# EasyEDA Pro project ProPrj_WatcheRobot2.0openSource_2026-06-17.epro, board 无线充电底座PCB
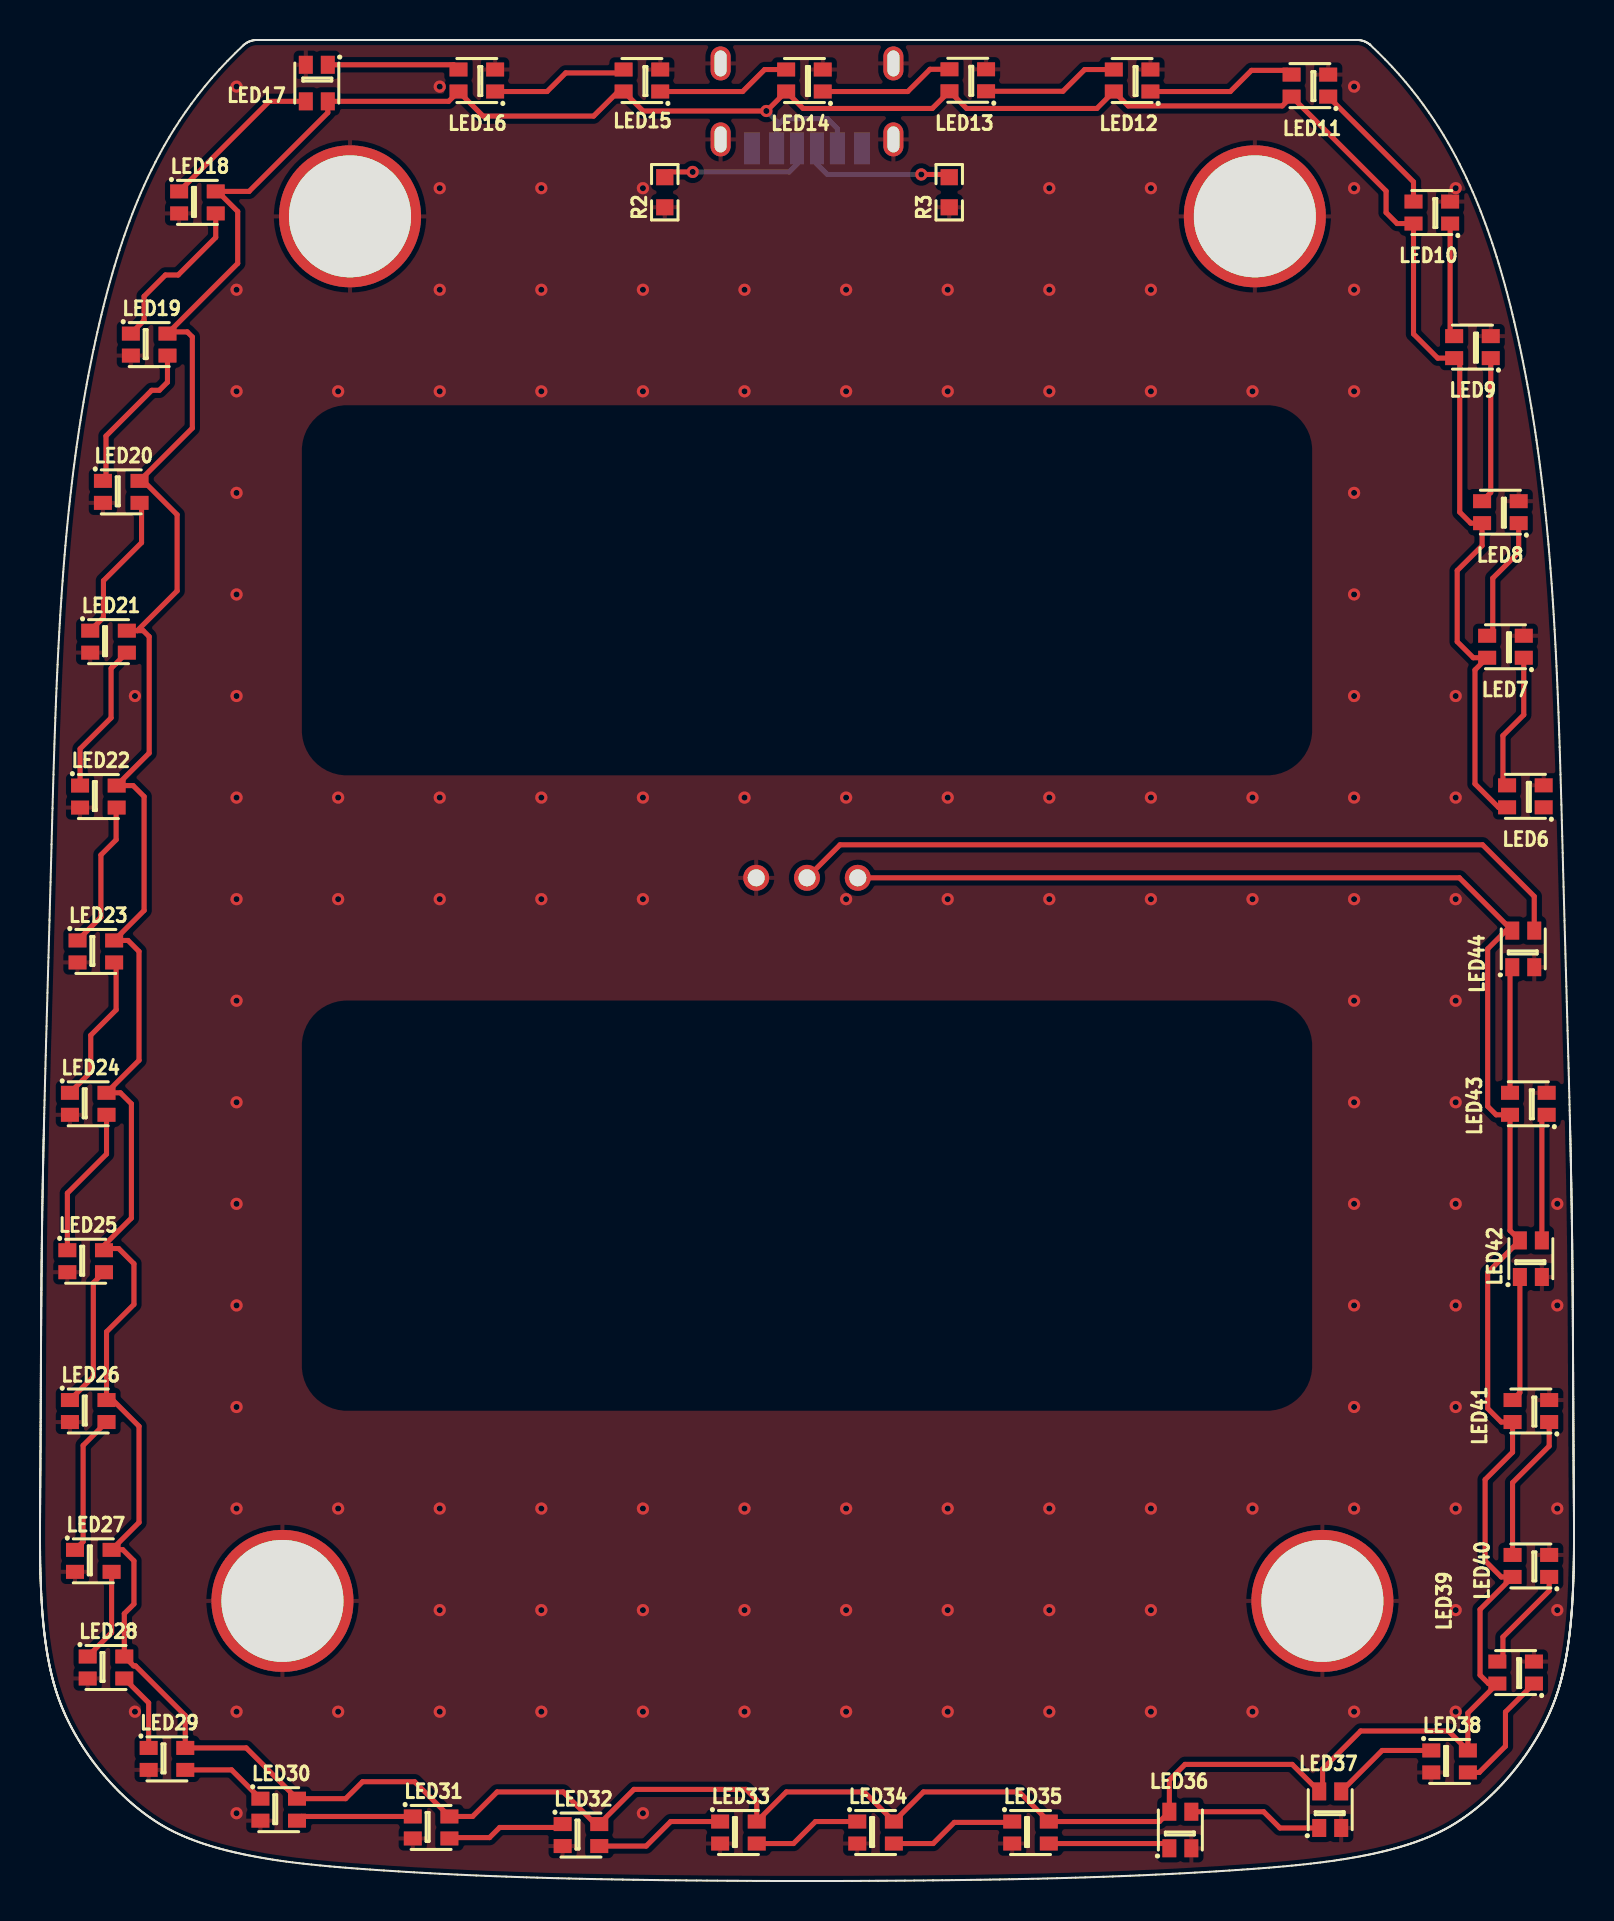
[diagram p4: board, top side]
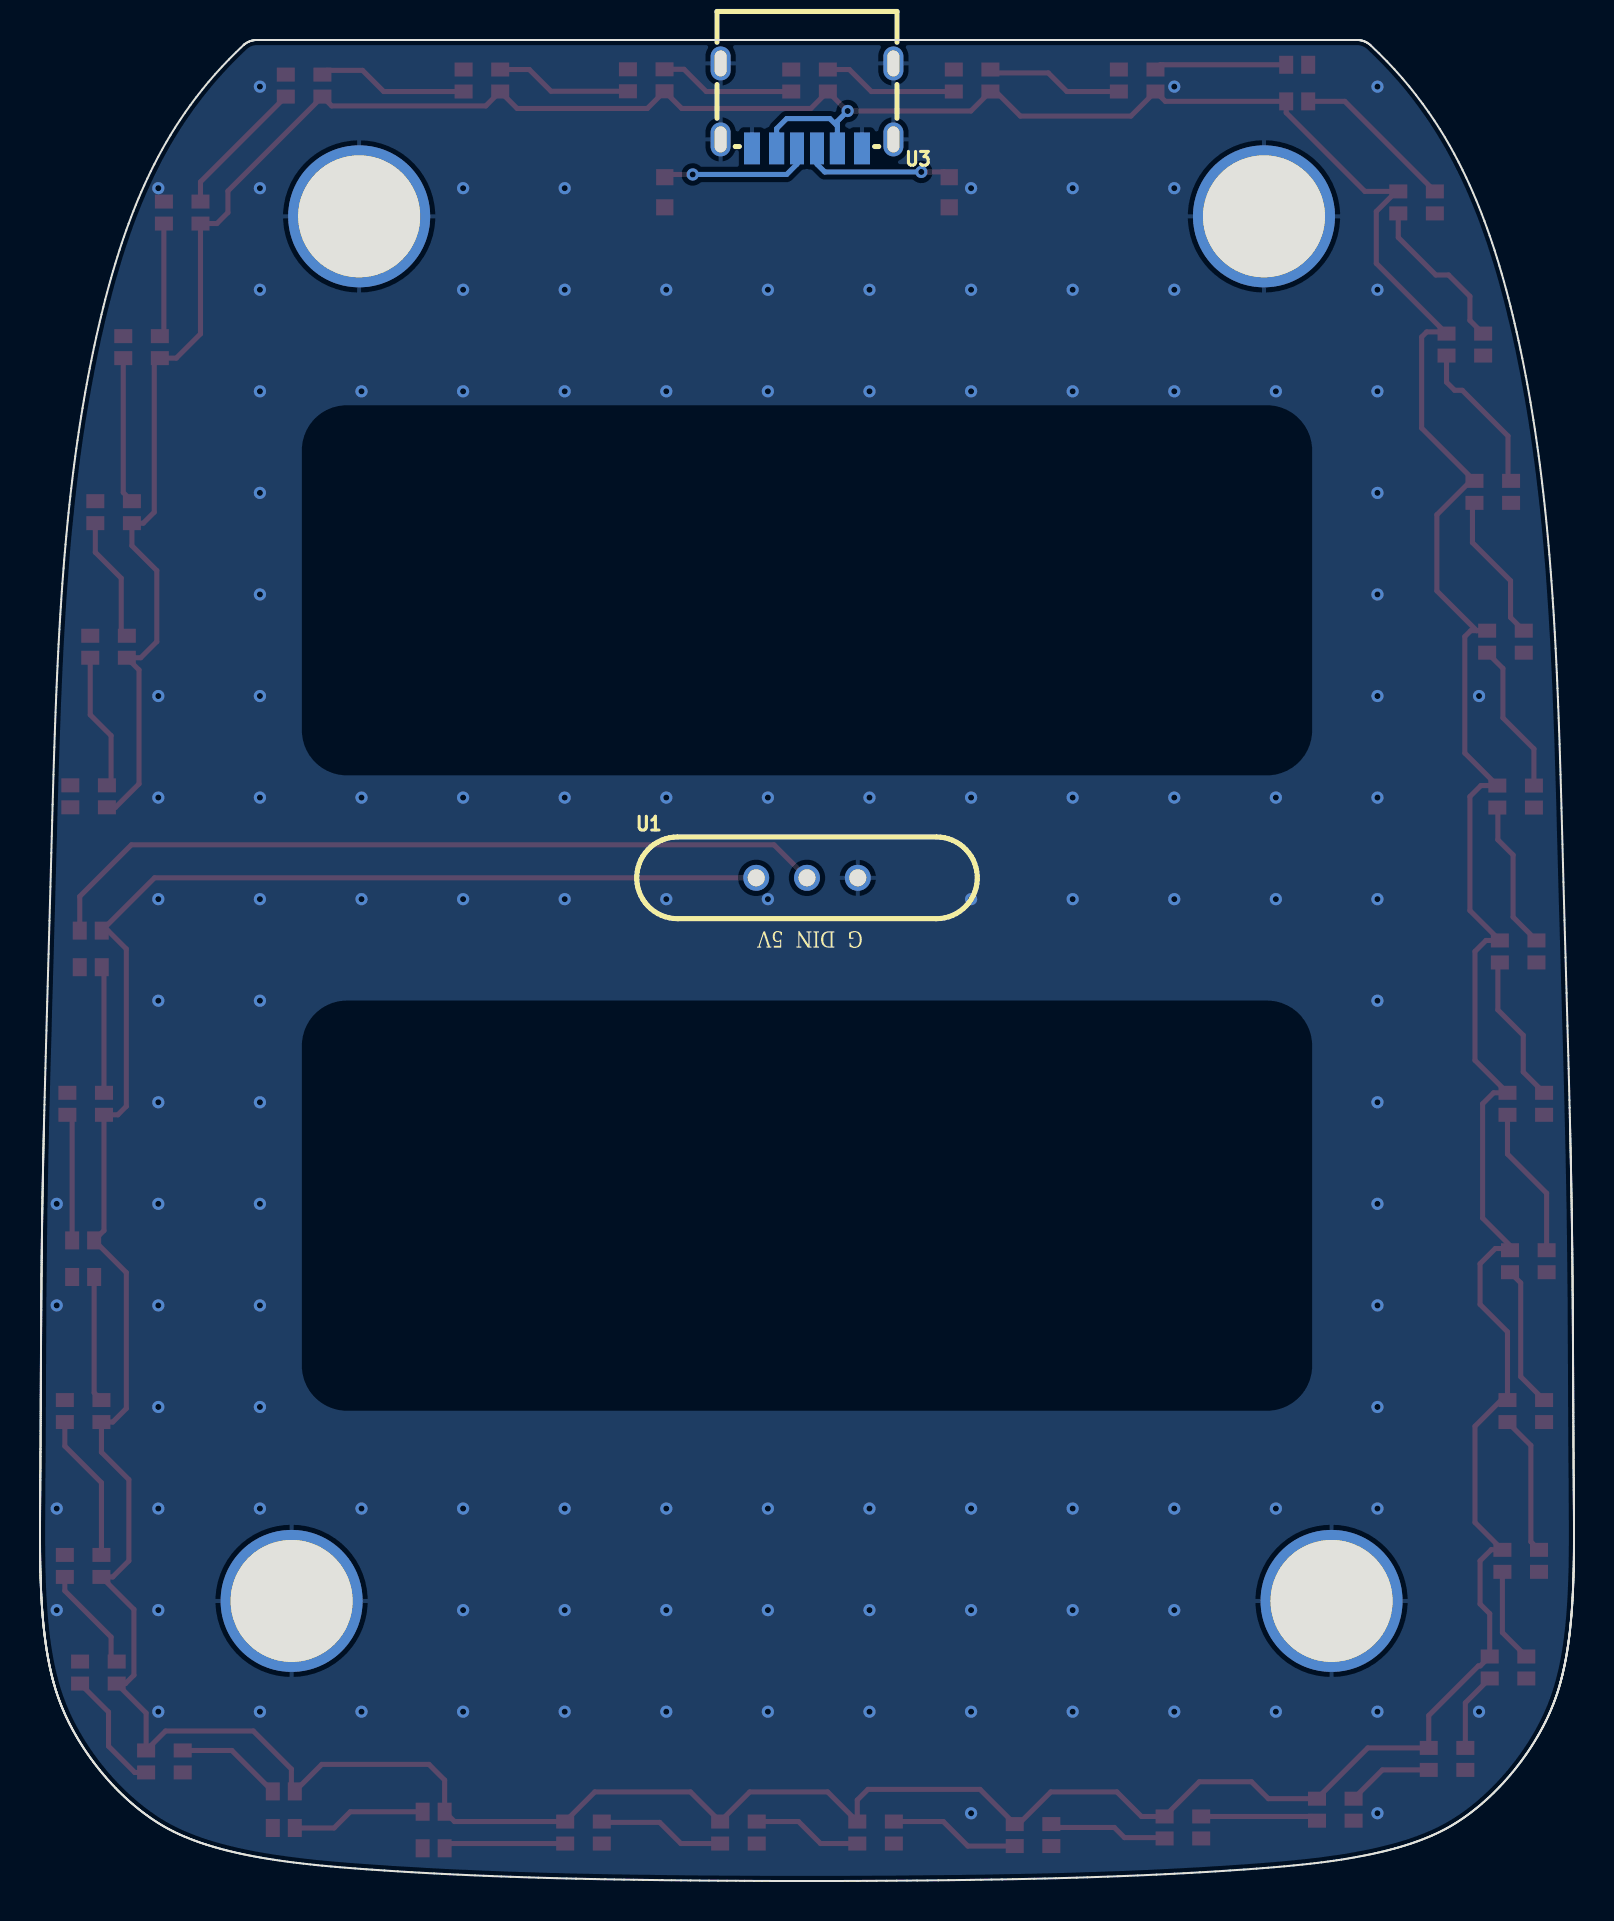
[diagram p5: board, bottom side, seen from below]

Outline 76.7 x 92.08 mm; copper layers: Top Layer, Bottom Layer. Coordinates in mm from the lower left corner of the outline.
Stack: Top Layer 0.035mm / Dielectric1 1.51mm FR4 er 4.5 / Bottom Layer 0.035mm

## Design rules (mm)
spacing copperThickness1oz (default): track to track 0.102, other pairs 0.152 to 0.3
spacing copperThickness2oz: track to track 0.203, other pairs 0.152 to 0.3
track width copperThickness1oz (default): min 0.127, default 0.254, max 2.54
track width copperThickness2oz: min 0.203, default 0.254, max 2.54
differential pair differentialPair (default): width min 0.127, default 0.254, max 2.54; gap min 0.152, default 0.152
net GND uses copperRegion

## Placement (name value [footprint] x y rotation side)
LED6  WS2812B-2020  [LED-SMD_4P-L2.0-W2.0-TL_WS2812B-2020]  74.27 54.25 180 top
LED7  WS2812B-2020  [LED-SMD_4P-L2.0-W2.0-TL_WS2812B-2020]  73.28 61.73 180 top
LED8  WS2812B-2020  [LED-SMD_4P-L2.0-W2.0-TL_WS2812B-2020]  73.02 68.46 180 top
LED9  WS2812B-2020  [LED-SMD_4P-L2.0-W2.0-TL_WS2812B-2020]  71.63 76.72 180 top
LED10  WS2812B-2020  [LED-SMD_4P-L2.0-W2.0-TL_WS2812B-2020]  69.59 83.45 180 top
LED11  WS2812B-2020  [LED-SMD_4P-L2.0-W2.0-TL_WS2812B-2020]  63.5 89.8 180 top
LED12  WS2812B-2020  [LED-SMD_4P-L2.0-W2.0-TL_WS2812B-2020]  54.61 90.05 180 top
LED13  WS2812B-2020  [LED-SMD_4P-L2.0-W2.0-TL_WS2812B-2020]  46.39 90.07 180 top
LED14  WS2812B-2020  [LED-SMD_4P-L2.0-W2.0-TL_WS2812B-2020]  38.22 90.05 180 top
LED15  WS2812B-2020  [LED-SMD_4P-L2.0-W2.0-TL_WS2812B-2020]  30.1 90.05 180 top
LED16  WS2812B-2020  [LED-SMD_4P-L2.0-W2.0-TL_WS2812B-2020]  21.84 90.05 180 top
LED17  WS2812B-2020  [LED-SMD_4P-L2.0-W2.0-TL_WS2812B-2020]  13.84 89.93 270 top
LED18  WS2812B-2020  [LED-SMD_4P-L2.0-W2.0-TL_WS2812B-2020]  7.87 83.96 0 top
LED19  WS2812B-2020  [LED-SMD_4P-L2.0-W2.0-TL_WS2812B-2020]  5.46 76.85 0 top
LED20  WS2812B-2020  [LED-SMD_4P-L2.0-W2.0-TL_WS2812B-2020]  4.06 69.48 0 top
LED21  WS2812B-2020  [LED-SMD_4P-L2.0-W2.0-TL_WS2812B-2020]  3.43 61.99 0 top
LED22  WS2812B-2020  [LED-SMD_4P-L2.0-W2.0-TL_WS2812B-2020]  2.92 54.24 0 top
LED23  WS2812B-2020  [LED-SMD_4P-L2.0-W2.0-TL_WS2812B-2020]  2.79 46.49 0 top
LED24  WS2812B-2020  [LED-SMD_4P-L2.0-W2.0-TL_WS2812B-2020]  2.41 38.87 0 top
LED25  WS2812B-2020  [LED-SMD_4P-L2.0-W2.0-TL_WS2812B-2020]  2.28 31 0 top
LED26  WS2812B-2020  [LED-SMD_4P-L2.0-W2.0-TL_WS2812B-2020]  2.41 23.51 0 top
LED27  WS2812B-2020  [LED-SMD_4P-L2.0-W2.0-TL_WS2812B-2020]  2.67 16.01 0 top
LED28  WS2812B-2020  [LED-SMD_4P-L2.0-W2.0-TL_WS2812B-2020]  3.3 10.68 0 top
LED29  WS2812B-2020  [LED-SMD_4P-L2.0-W2.0-TL_WS2812B-2020]  6.35 6.11 0 top
LED30  WS2812B-2020  [LED-SMD_4P-L2.0-W2.0-TL_WS2812B-2020]  11.94 3.57 0 top
LED31  WS2812B-2020  [LED-SMD_4P-L2.0-W2.0-TL_WS2812B-2020]  19.56 2.68 0 top
LED32  WS2812B-2020  [LED-SMD_4P-L2.0-W2.0-TL_WS2812B-2020]  27.05 2.3 0 top
LED33  WS2812B-2020  [LED-SMD_4P-L2.0-W2.0-TL_WS2812B-2020]  34.92 2.42 0 top
LED34  WS2812B-2020  [LED-SMD_4P-L2.0-W2.0-TL_WS2812B-2020]  41.78 2.42 0 top
LED35  WS2812B-2020  [LED-SMD_4P-L2.0-W2.0-TL_WS2812B-2020]  49.53 2.42 0 top
LED36  WS2812B-2020  [LED-SMD_4P-L2.0-W2.0-TL_WS2812B-2020]  57.02 2.55 90 top
LED37  WS2812B-2020  [LED-SMD_4P-L2.0-W2.0-TL_WS2812B-2020]  64.51 3.57 90 top
LED38  WS2812B-2020  [LED-SMD_4P-L2.0-W2.0-TL_WS2812B-2020]  70.48 5.98 0 top
LED39  WS2812B-2020  [LED-SMD_4P-L2.0-W2.0-TL_WS2812B-2020]  73.78 10.43 180 top
LED40  WS2812B-2020  [LED-SMD_4P-L2.0-W2.0-TL_WS2812B-2020]  74.55 15.76 180 top
LED41  WS2812B-2020  [LED-SMD_4P-L2.0-W2.0-TL_WS2812B-2020]  74.55 23.51 180 top
LED42  WS2812B-2020  [LED-SMD_4P-L2.0-W2.0-TL_WS2812B-2020]  74.55 31.13 90 top
LED43  WS2812B-2020  [LED-SMD_4P-L2.0-W2.0-TL_WS2812B-2020]  74.42 38.87 180 top
LED44  WS2812B-2020  [LED-SMD_4P-L2.0-W2.0-TL_WS2812B-2020]  74.17 46.62 90 top
NOREF  -  [Pad_e24]  60.75 83.26 0 top
NOREF#2  -  [Pad_e26]  64.12 14.01 0 top
NOREF#3  -  [Pad_e25]  15.5 83.26 0 top
NOREF#4  -  [Pad_e27]  12.12 14.01 0 top
R2  5.1kΩ  [R0603_3]  31.24 84.47 90 top
R3  5.1kΩ  [R0603_3]  45.46 84.47 90 top
U1  PR5L5015-3P-C-H  [CONN-TH_PR5L5015-3P-C-H]  38.35 50.18 180 bottom
U3  YTC-TC6-268  [TYPE-C-SMD_YIYUAN_YTC-TC6-268]  38.35 88.78 0 bottom

## Footprints (pads in the part's own frame, mm; a bottom-side part is the same pattern mirrored in y, then rotated)
CONN-TH_PR5L5015-3P-C-H
  round 1.3 hole 0.85: 1(-2.54,0) 2(0,0) 3(2.54,0)
LED-SMD_4P-L2.0-W2.0-TL_WS2812B-2020
  rect 0.9x0.7 smd: 1(-0.915,0.55) 2(-0.915,-0.55) 3(0.915,-0.55) 4(0.915,0.55)
Pad_e24
  round 7.1 hole 6.1: (0,0)
Pad_e25
  round 7.1 hole 6.1: (0,0)
Pad_e26
  round 7.1 hole 6.1: (0,0)
Pad_e27
  round 7.1 hole 6.1: (0,0)
R0603_3
  rect 0.806x0.864 smd: 1(-0.753,0) 2(0.753,0)
TYPE-C-SMD_YIYUAN_YTC-TC6-268
  oval 1x1.7 hole 0.6x1.3: 1(-4.32,1.675) 2(4.32,1.675) 3(4.32,-2.124) 4(-4.32,-2.124)
  rect 0.7x1.6 smd: A5(-0.5,2.124) B5(0.5,2.124)
  rect 0.76x1.6 smd: A9(1.52,2.124) B9(-1.52,2.124)
  rect 0.8x1.6 smd: A12(2.75,2.124) B12(-2.75,2.124)

## Nets
As in the schematic, except:
GND: LED6.2 LED7.2 LED8.2 LED9.2 LED10.2 LED11.2 LED12.2 LED13.2 LED14.2 LED15.2 LED16.2 LED17.2 LED18.2 LED19.2 LED20.2 LED21.2 LED22.2 LED23.2 LED24.2 LED25.2 LED26.2 LED27.2 LED28.2 LED29.2 LED30.2 LED31.2 LED32.2 LED33.2 LED34.2 LED35.2 LED36.2 LED37.2 LED38.2 LED39.2 LED40.2 LED41.2 LED42.2 LED43.2 LED44.2 NOREF. NOREF#2. NOREF#3. NOREF#4. R2.1 R3.1 U1.3 U3.1 U3.2 U3.3 U3.4 U3.A12 U3.B12

Pads without a net: LED6 1

## Via types
v1: diameter 0.61, hole 0.305, Top Layer to Bottom Layer, 125 vias

## Routing (per net, layer and track width the routed paths; a pad name or vN(x,y) marks a point on that pad's centre or on a via; arc(x,y) is an arc through that point)
GND:
  vias: v1(4.75,59.27) v1(4.75,8.47) v1(9.83,89.75) v1(9.83,79.59) v1(9.83,74.51) v1(9.83,69.43) v1(9.83,64.35) v1(9.83,59.27) v1(9.83,54.19) v1(9.83,49.11) v1(9.83,44.03) v1(9.83,38.95) v1(9.83,33.87) v1(9.83,28.79) v1(9.83,23.71) v1(9.83,18.63) v1(9.83,8.47) v1(9.83,3.39) v1(14.91,74.51) v1(14.91,54.19) v1(14.91,49.11) v1(14.91,18.63) v1(14.91,8.47) v1(19.99,89.75) v1(19.99,84.67) v1(19.99,79.59) v1(19.99,74.51) v1(19.99,54.19) v1(19.99,49.11) v1(19.99,18.63) v1(19.99,13.55) v1(19.99,8.47) v1(25.07,84.67) v1(25.07,79.59) v1(25.07,74.51) v1(25.07,54.19) v1(25.07,49.11) v1(25.07,18.63) v1(25.07,13.55) v1(25.07,8.47) v1(30.15,84.67) v1(30.15,79.59) v1(30.15,74.51) v1(30.15,54.19) v1(30.15,49.11) v1(30.15,18.63) v1(30.15,13.55) v1(30.15,8.47) v1(30.15,3.39) v1(35.23,79.59) v1(35.23,74.51) v1(35.23,54.19) v1(35.23,18.63) v1(35.23,13.55) v1(35.23,8.47) v1(40.31,79.59) v1(40.31,74.51) v1(40.31,54.19) v1(40.31,49.11) v1(40.31,18.63) v1(40.31,13.55) v1(40.31,8.47) v1(45.39,79.59) v1(45.39,74.51) v1(45.39,54.19) v1(45.39,49.11) v1(45.39,18.63) v1(45.39,13.55) v1(45.39,8.47) v1(50.47,84.67) v1(50.47,79.59) v1(50.47,74.51) v1(50.47,54.19) v1(50.47,49.11) v1(50.47,18.63) v1(50.47,13.55) v1(50.47,8.47) v1(55.55,84.67) v1(55.55,79.59) v1(55.55,74.51) v1(55.55,54.19) v1(55.55,49.11) v1(55.55,18.63) v1(55.55,13.55) v1(55.55,8.47) v1(60.63,74.51) v1(60.63,54.19) v1(60.63,49.11) v1(60.63,18.63) v1(60.63,8.47) v1(65.71,89.75) v1(65.71,84.67) v1(65.71,79.59) v1(65.71,74.51) v1(65.71,69.43) v1(65.71,64.35) v1(65.71,59.27) v1(65.71,54.19) v1(65.71,49.11) v1(65.71,44.03) v1(65.71,38.95) v1(65.71,33.87) v1(65.71,28.79) v1(65.71,23.71) v1(65.71,18.63) v1(65.71,8.47) v1(70.79,84.67) v1(70.79,59.27) v1(70.79,54.19) v1(70.79,49.11) v1(70.79,44.03) v1(70.79,38.95) v1(70.79,33.87) v1(70.79,28.79) v1(70.79,23.71) v1(70.79,18.63) v1(70.79,13.55) v1(70.79,8.47) v1(75.87,33.87) v1(75.87,28.79) v1(75.87,18.63) v1(75.87,13.55)
VCC_5V: length 363.6
  Top Layer w0.254: LED18.4 8.88,84.51 ; 8.88,84.51 9.89,83.5 9.89,80.91 6.46,77.48 ; 8.88,84.51 10.45,84.51 14.39,88.45 14.39,89.01 20.44,89.01 LED16.4 22.16,88.28 27.68,88.28 28.91,89.5 LED15.4 30.16,88.53 36.34,88.53 LED14.4 38.16,88.66 44.62,88.66 LED13.4 46.33,88.66 52.85,88.66 LED12.4 54.41,88.78 62.12,88.78 LED11.4 67.31,84.53 67.31,83.45 67.86,82.9 68.68,82.9 68.68,77.38 69.89,76.17 LED9.4 70.99,75.89 70.99,68.46 71.54,67.91 LED8.4 72.11,66.79 70.86,65.54 70.86,61.99 71.67,61.18 LED7.4 71.75,60.57 71.75,54.88 72.93,53.7 LED6.4 ; 3.59,16.57 4.14,16.57 4.7,16.01 4.7,13.85 4.22,13.37 LED28.4 4.69,10.76 4.78,10.76 7.26,8.28 LED29.4 10.31,6.66 LED30.4 15.28,4.12 16.13,4.96 18.74,4.96 LED31.4 21.63,3.23 22.86,4.46 26.16,4.46 27.77,2.85 LED32.4 29.7,4.58 35.3,4.58 35.84,4.05 LED33.4 37.32,4.46 41.21,4.46 LED34.4 44.18,4.46 48.96,4.46 50.44,2.97 55.98,2.97 56.47,3.47 56.47,5.05 57.25,5.83 62.61,5.83 LED37.4 64.13,4.65 64.13,5.6 66.04,7.5 70.42,7.5 LED38.4 71.4,8.4 LED39.4 72.43,9.88 72.01,10.3 72.01,13.58 LED40.4 73.06,15.21 72.26,16.01 72.26,20.08 73.63,21.45 LED41.4 73.06,22.96 72.39,23.63 72.39,30.43 LED42.4 73.5,32.53 73.5,38.32 72.81,38.32 72.39,38.75 72.39,46.62 73.3,47.54 LED44.4 70.97,50.18 U1.1 ; 3.59,16.57 4.95,17.93 4.95,22.74 3.64,24.06 LED26.4 3.33,27.47 4.7,28.84 4.7,30.87 3.94,31.63 3.28,31.63 LED25.4 3.2,31.79 4.57,33.16 4.57,38.87 4.02,39.42 LED24.4 4.95,41.05 4.95,46.49 4.4,47.04 LED23.4 5.2,48.54 5.2,54.24 4.66,54.79 LED22.4 5.46,56.42 5.46,62.24 5.16,62.54 4.87,62.54 ; 3.59,16.57 LED27.4 ; 4.87,62.54 6.86,64.53 6.86,68.34 5.16,70.03 4.98,70.03 7.62,72.67 7.62,77.23 7.36,77.48 6.46,77.48 ; 4.87,62.54 LED21.4 ; 6.46,77.48 LED19.4
  Bottom Layer w0.254: U3.B9 36.83,87.77 ; 36.83,87.77 36.83,88.02 v1(36.32,88.53) ; 36.83,87.77 37.21,88.15 39.37,88.15 39.87,87.65 U3.A9
WS2812_BOTTOM_DIN: length 39.8
  Top Layer w0.254: U1.2 40,51.83 72.13,51.83 74.72,49.25 LED44.3
$1N33: length 7.7
  Top Layer w0.254: v1(44.07,85.36) 45.33,85.36 R3.2
  Bottom Layer w0.254: U3.B5 38.85,85.87 39.37,85.36 v1(44.07,85.36)
$1N34: length 7.7
  Top Layer w0.254: v1(32.64,85.48) 31.5,85.48 R2.2
  Bottom Layer w0.254: v1(32.64,85.48) 37.46,85.48 37.85,85.87 U3.A5
$1N50: length 6.3
  Top Layer w0.254: LED44.1 73.5,45.59 73.5,39.42
$1N53: length 6.9
  Top Layer w0.254: LED7.1 74.19,58.33 73.15,57.29 73.15,55.01 LED6.3
$1N54: length 6.3
  Top Layer w0.254: LED8.1 73.94,66.46 72.64,65.16 72.64,62.56 LED7.3
$1N55: length 7.3
  Top Layer w0.254: LED8.3 72.54,69.45 LED9.1
$1N56: length 5.7
  Top Layer w0.254: LED9.3 70.51,77.47 70.51,82.9
$1N57: length 7
  Top Layer w0.254: LED10.3 68.68,84.98 LED11.1
$1N58: length 7.6
  Top Layer w0.254: LED12.1 59.52,89.5 60.58,90.56 62.37,90.56 LED11.3
$1N59: length 6.8
  Top Layer w0.254: LED13.1 51.15,89.52 52.24,90.6 LED12.3
$1N60: length 6.8
  Top Layer w0.254: LED14.1 43.39,89.5 44.5,90.62 LED13.3
$1N61: length 6.8
  Top Layer w0.254: LED14.3 36.24,90.6 35.13,89.5 LED15.1
$1N62: length 6.9
  Top Layer w0.254: LED16.1 25.36,89.5 26.29,90.44 29.01,90.44 LED15.3
$1N63: length 6.6
  Top Layer w0.254: LED17.1 20.69,90.84 LED16.3
$1N64: length 8.2
  Top Layer w0.254: LED18.1 11.46,89.01 13.29,89.01
$1N65: length 8.1
  Top Layer w0.254: LED19.1 5.2,78.06 5.2,79.26 6.27,80.33 6.91,80.33 8.79,82.21 LED18.3
$1N66: length 7.8
  Top Layer w0.254: LED19.3 6.37,74.97 5.97,74.56 5.59,74.56 3.3,72.27 3.3,70.18 3.15,70.03
$1N67: length 7.5
  Top Layer w0.254: LED20.3 5.08,68.83 5.08,66.94 3.17,65.04 3.17,63.2 LED21.1
$1N68: length 7.6
  Top Layer w0.254: LED21.3 3.55,60.65 3.55,58.18 2,56.63 LED22.1
$1N69: length 7.5
  Top Layer w0.254: LED22.3 3.81,53.66 3.81,52.08 3.05,51.32 3.05,48.21 LED23.1
$1N70: length 7.5
  Top Layer w0.254: LED24.1 2.54,40.47 2.54,42.3 3.81,43.57 3.81,45.84 LED23.3
$1N73: length 7.6
  Top Layer w0.254: LED25.1 1.37,34.4 3.33,36.36 LED24.3
$1N74: length 7.1
  Top Layer w0.254: LED26.1 2.67,25.23 2.67,29.92 LED25.3
$1N75: length 6.4
  Top Layer w0.254: LED42.3 75.1,38.09 LED43.1
$1N76: length 6.3
  Top Layer w0.254: LED42.1 74,24.42 LED41.3
$1N77: length 7.4
  Top Layer w0.254: LED41.1 75.46,21.75 73.63,19.92 LED40.3
$1N78: length 5.3
  Top Layer w0.254: LED40.1 75.46,14.52 73.15,12.2 73.15,11.26 LED39.3
$1N79: length 6.1
  Top Layer w0.254: LED39.1 73.28,8.45 73.28,6.74 71.97,5.43 71.4,5.43
$1N80: length 5.4
  Top Layer w0.254: LED38.1 67.11,6.53 LED37.3
$1N81: length 6.7
  Top Layer w0.254: 63.96,2.65 62,2.65 61.19,3.47 57.57,3.47
$1N82: length 6.1
  Top Layer w0.254: 50.44,1.87 56.23,1.87 LED36.1
$1N83: length 6.4
  Top Layer w0.254: LED35.1 48.57,2.93 45.72,2.93 44.66,1.87 LED34.3
$1N84: length 5.5
  Top Layer w0.254: LED33.3 37.68,1.87 38.78,2.97 LED34.1
$1N85: length 6.6
  Top Layer w0.254: LED33.1 31.54,2.97 30.31,1.75 LED32.3
$1N86: length 6
  Top Layer w0.254: LED31.3 20.51,2.17 22.48,2.17 22.99,2.68 25.97,2.68 LED32.1
$1N87: length 5.9
  Top Layer w0.254: LED30.3 13.06,3.23 18.64,3.23
$1N88: length 4.4
  Top Layer w0.254: LED30.1 9.58,5.56 LED29.3
$1N89: length 4
  Top Layer w0.254: LED28.3 5.43,8.91 LED29.1
$1N90: length 4.7
  Top Layer w0.254: LED28.1 3.58,12.42 LED27.3
$1N91: length 7
  Top Layer w0.254: LED26.3 2.16,21.79 2.16,16.97 LED27.1

## Copper pours and planes (outline as drawn; the poured copper is in the pictures)
GND on Top Layer: -4.45,99.58 82.93,99.58 82.93,-1.51 -4.45,-1.51
GND on Bottom Layer: -13.84,105.68 91.95,105.68 91.95,-14.59 -13.84,-14.59

## Text on the board
Bottom Silkscreen Layer: G  DIN  5V
